# EAGLE design USB_RS232_Adaper_V1 (EAGLE 9.6.2)
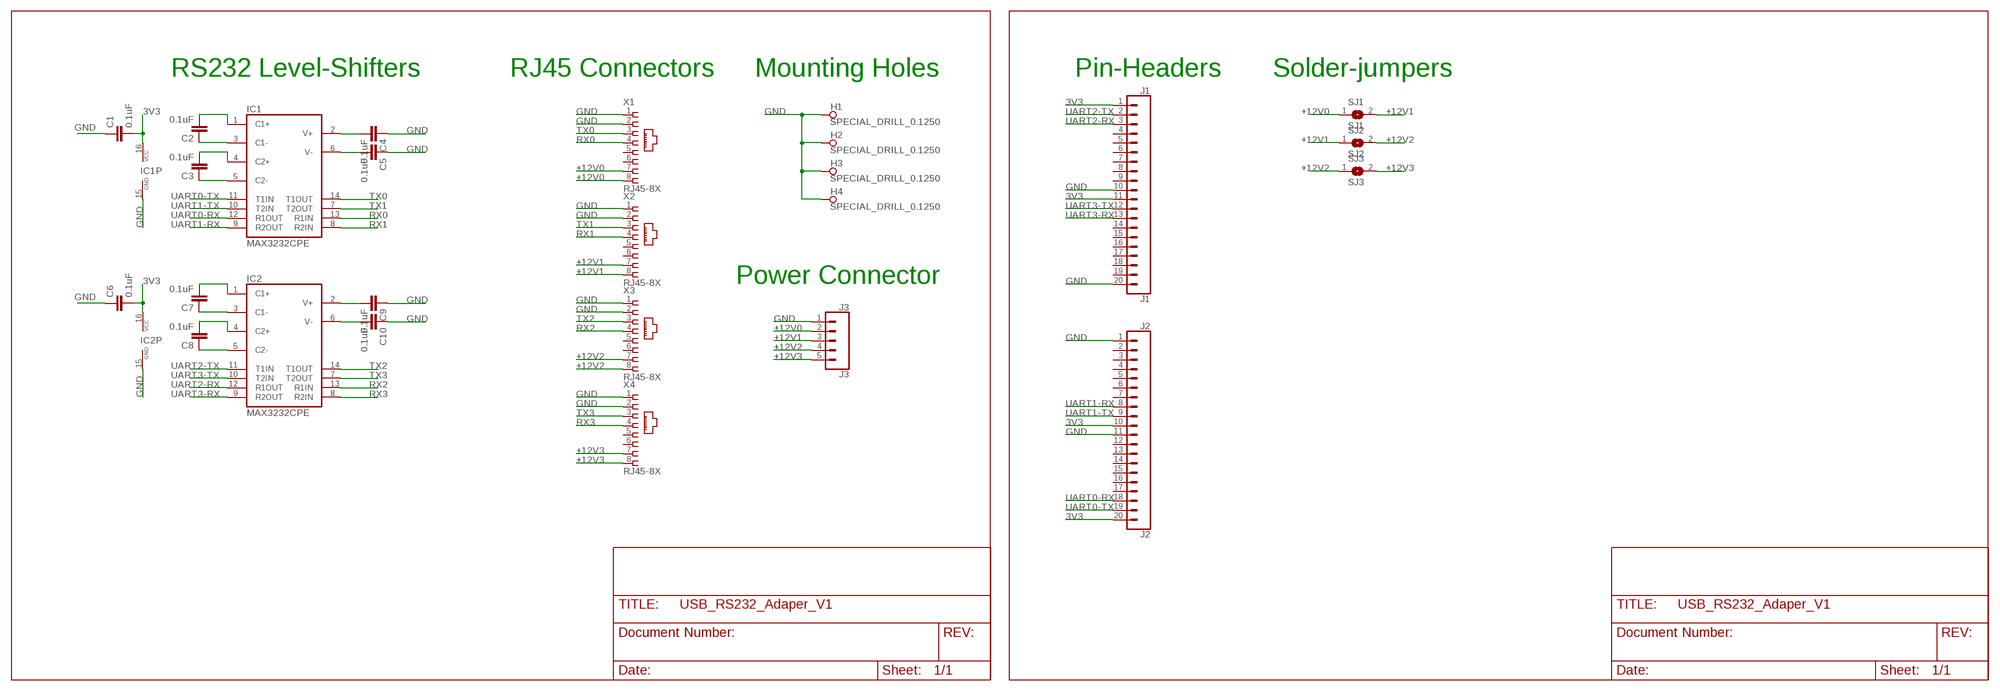
[diagram p0: schematic, sheet 1]

## Parts
C1  0.1uF  0.1UF-KIT-EZ-50V-20%  [CAP-PTH-SMALL-KIT]
C2  0.1uF  0.1UF-KIT-EZ-50V-20%  [CAP-PTH-SMALL-KIT]
C3  0.1uF  0.1UF-KIT-EZ-50V-20%  [CAP-PTH-SMALL-KIT]
C4  0.1uF  0.1UF-KIT-EZ-50V-20%  [CAP-PTH-SMALL-KIT]
C5  0.1uF  0.1UF-KIT-EZ-50V-20%  [CAP-PTH-SMALL-KIT]
C6  0.1uF  0.1UF-KIT-EZ-50V-20%  [CAP-PTH-SMALL-KIT]
C7  0.1uF  0.1UF-KIT-EZ-50V-20%  [CAP-PTH-SMALL-KIT]
C8  0.1uF  0.1UF-KIT-EZ-50V-20%  [CAP-PTH-SMALL-KIT]
C9  0.1uF  0.1UF-KIT-EZ-50V-20%  [CAP-PTH-SMALL-KIT]
C10  0.1uF  0.1UF-KIT-EZ-50V-20%  [CAP-PTH-SMALL-KIT]
H1  SPECIAL_DRILL_0.1250  [PAD_0.1250]
H2  SPECIAL_DRILL_0.1250  [PAD_0.1250]
H3  SPECIAL_DRILL_0.1250  [PAD_0.1250]
H4  SPECIAL_DRILL_0.1250  [PAD_0.1250]
IC1  MAX3232CPE  [DIL16]
IC2  MAX3232CPE  [DIL16]
J1  J1  CONN_20  [1X20]
J2  J2  CONN_20  [1X20]
J3  J3  CONN_05  [1X05]
SJ1  SJ1  SJ  [SJ]
SJ2  SJ2  SJ  [SJ]
SJ3  SJ3  SJ  [SJ]
X1  RJ45-8X  [RJ45-NO-SHIELD]
X2  RJ45-8X  [RJ45-NO-SHIELD]
X3  RJ45-8X  [RJ45-NO-SHIELD]
X4  RJ45-8X  [RJ45-NO-SHIELD]

## Nets
3V3: C1.2 C6.2 IC1.16(VCC) IC2.16(VCC) J1.1 J1.11 J2.10 J2.20
+12V0: J3.2 SJ1.1 X1.7 X1.8
+12V1: J3.3 SJ1.2 SJ2.1 X2.7 X2.8
+12V2: J3.4 SJ2.2 SJ3.1 X3.7 X3.8
+12V3: J3.5 SJ3.2 X4.7 X4.8
GND: C1.1 C4.1 C5.1 C6.1 C9.1 C10.1 H1.1 H2.1 H3.1 H4.1 IC1.15(GND) IC2.15(GND) J1.10 J1.20 J2.1 J2.11 J3.1 X1.1 X1.2 X2.1 X2.2 X3.1 X3.2 X4.1 X4.2
N$1: C4.2 IC1.2(V+)
N$2: C5.2 IC1.6(V-)
N$3: C2.1 IC1.3(C1-)
N$4: C2.2 IC1.1(C1+)
N$5: C3.1 IC1.5(C2-)
N$6: C3.2 IC1.4(C2+)
N$7: C9.2 IC2.2(V+)
N$8: C10.2 IC2.6(V-)
N$9: C7.1 IC2.3(C1-)
N$10: C7.2 IC2.1(C1+)
N$11: C8.1 IC2.5(C2-)
N$12: C8.2 IC2.4(C2+)
RX0: IC1.13(R1IN) X1.4
RX1: IC1.8(R2IN) X2.4
RX2: IC2.13(R1IN) X3.4
RX3: IC2.8(R2IN) X4.4
TX0: IC1.14(T1OUT) X1.3
TX1: IC1.7(T2OUT) X2.3
TX2: IC2.14(T1OUT) X3.3
TX3: IC2.7(T2OUT) X4.3
UART0-RX: IC1.12(R1OUT) J2.18
UART0-TX: IC1.11(T1IN) J2.19
UART1-RX: IC1.9(R2OUT) J2.8
UART1-TX: IC1.10(T2IN) J2.9
UART2-RX: IC2.12(R1OUT) J1.3
UART2-TX: IC2.11(T1IN) J1.2
UART3-RX: IC2.9(R2OUT) J1.13
UART3-TX: IC2.10(T2IN) J1.12
Unconnected: J1.4 J1.5 J1.6 J1.7 J1.8 J1.9 J1.14 J1.15 J1.16 J1.17 J1.18 J1.19 J2.2 J2.3 J2.4 J2.5 J2.6 J2.7 J2.12 J2.13 J2.14 J2.15 J2.16 J2.17 X1.5 X1.6 X2.5 X2.6 X3.5 X3.6 X4.5 X4.6

## Notes on the sheet
- RS232 Level-Shifters | RJ45 Connectors | Mounting Holes | Pin-Headers | Solder-jumpers
- Power Connector

## Library data of the parts
C1-C10 = SparkFun-Capacitors:0.1UF: 0.1µF ceramic capacitors A capacitor is a passive two-terminal electrical component used to store electrical energy temporarily in an electric field.; PROD_ID: CAP-08370
H1-H4 = special-drill:SPECIAL_DRILL_: Special drills
IC1 IC2 = maxim:MAX3232*: True RS-232 Transceivers 3.0V to 5.5V, Low-Power up to 1Mbps, Using Four 0.1µF External Capacitors Source: http://pdfserv.maxim-ic.com/en/ds/MAX3222-MAX3241.pdf; MF: MAXIM; MPN: MAX3232CPE+; OC_FARNELL: 9724494; OC_NEWARK: 68K4626
J1 J2 = SparkFun-Connectors:CONN_20: Multi connection point. Often used as Generic Header-pin footprint for 0.1 inch spaced/style header connections On any of the 0.1 inch spaced packages, you can populate with these: Break Away Headers - Straight <https://www.sparkfun.com/products/116> (PRT-00116) Break Away Male Headers - Right Angle <https://www.sparkfun.com/products/553> (PRT-00553) Female Headers <https://www.sparkfun.com/products/115> (PRT-00115) Break Away Headers - Machine Pin <https://www.sparkfun.com/products/117> (PRT-00117) Break Away Female Headers - Swiss Machine Pin <https://www.sparkfun.com/products/743> (PRT-00743) For SCREWTERMINALS and SPRING TERMINALS visit here: Screw Terimnals on SparkFun.com <https://www.sparkfun.com/search/results?term=Screw+Terminals> (5mm/3.5mm/2.54mm spacing) This device is also useful as a general connection point to wire up your design to another part of your project. Our various solder wires solder well into these plated through hole pads. Hook-Up Wire - Assortment (Stranded, 22 AWG) <https://www.sparkfun.com/products/11375> (PRT-11375) Hook-Up Wire - Assortment (Solid Core, 22 AWG) <https://www.sparkfun.com/products/11367> (PRT-11367) View the entire wire category on our website here <https://www.sparkfun.com/categories/141> Special notes: Molex polarized connector foot print use with SKU : PRT-08231 with associated crimp pins and housings. 1MM SMD Version SKU: PRT-10208 NOTES ON THE VARIANTS LOCK and LOCK_LONGPADS... This footprint was designed to help hold the alignment of a through-hole component (i.e. 6-pin header) while soldering it into place. You may notice that each hole has been shifted either up or down by 0.005 of an inch from it's more standard position (which is a perfectly straight line). This slight alteration caused the pins (the squares in the middle) to touch the edges of the holes. Because they are alternating, it causes a "brace" to hold the component in place. 0.005 has proven to be the perfect amount of "off-center" position when using our standard breakaway headers. Although looks a little odd when you look at the bare footprint, once you have a header in there, the alteration is very hard to notice. Also,if you push a header all the way into place, it is covered up entirely on the bottom side. Note about LOCK SPECIAL package: This is just like the LOCK variant in that the holes are staggared by 5 mil, but except for the last two holes. They are not altered from the "standard" footprint layout. This is used for a special purpose on the layout of our Graphic LCD Backpack. Make sure you want to use this device before selecting it for you project!
J3 = SparkFun-Connectors:CONN_05: Multi connection point. Often used as Generic Header-pin footprint for 0.1 inch spaced/style header connections On any of the 0.1 inch spaced packages, you can populate with these: Break Away Headers - Straight <https://www.sparkfun.com/products/116> (PRT-00116) Break Away Male Headers - Right Angle <https://www.sparkfun.com/products/553> (PRT-00553) Female Headers <https://www.sparkfun.com/products/115> (PRT-00115) Break Away Headers - Machine Pin <https://www.sparkfun.com/products/117> (PRT-00117) Break Away Female Headers - Swiss Machine Pin <https://www.sparkfun.com/products/743> (PRT-00743) For SCREWTERMINALS and SPRING TERMINALS visit here: Screw Terimnals on SparkFun.com <https://www.sparkfun.com/search/results?term=Screw+Terminals> (5mm/3.5mm/2.54mm spacing) This device is also useful as a general connection point to wire up your design to another part of your project. Our various solder wires solder well into these plated through hole pads. Hook-Up Wire - Assortment (Stranded, 22 AWG) <https://www.sparkfun.com/products/11375> (PRT-11375) Hook-Up Wire - Assortment (Solid Core, 22 AWG) <https://www.sparkfun.com/products/11367> (PRT-11367) View the entire wire category on our website here <https://www.sparkfun.com/categories/141> Special notes: Molex polarized connector foot print use with SKU : PRT-08231 with associated crimp pins and housings. 1MM SMD Version SKU: PRT-10208
SJ1-SJ3 = jumper:SJ: SMD solder JUMPER
X1-X4 = con-tycoelectronics:RJ45: CORCOM Modular RJ Jacks No Shield Source: www.tycoelectronics.com .. ENG_DS_1654001_1099_RJ_L_0507.pdf; MPN: RJ45-8X; OC_FARNELL: unknown; OC_NEWARK: 16R6101

## Board
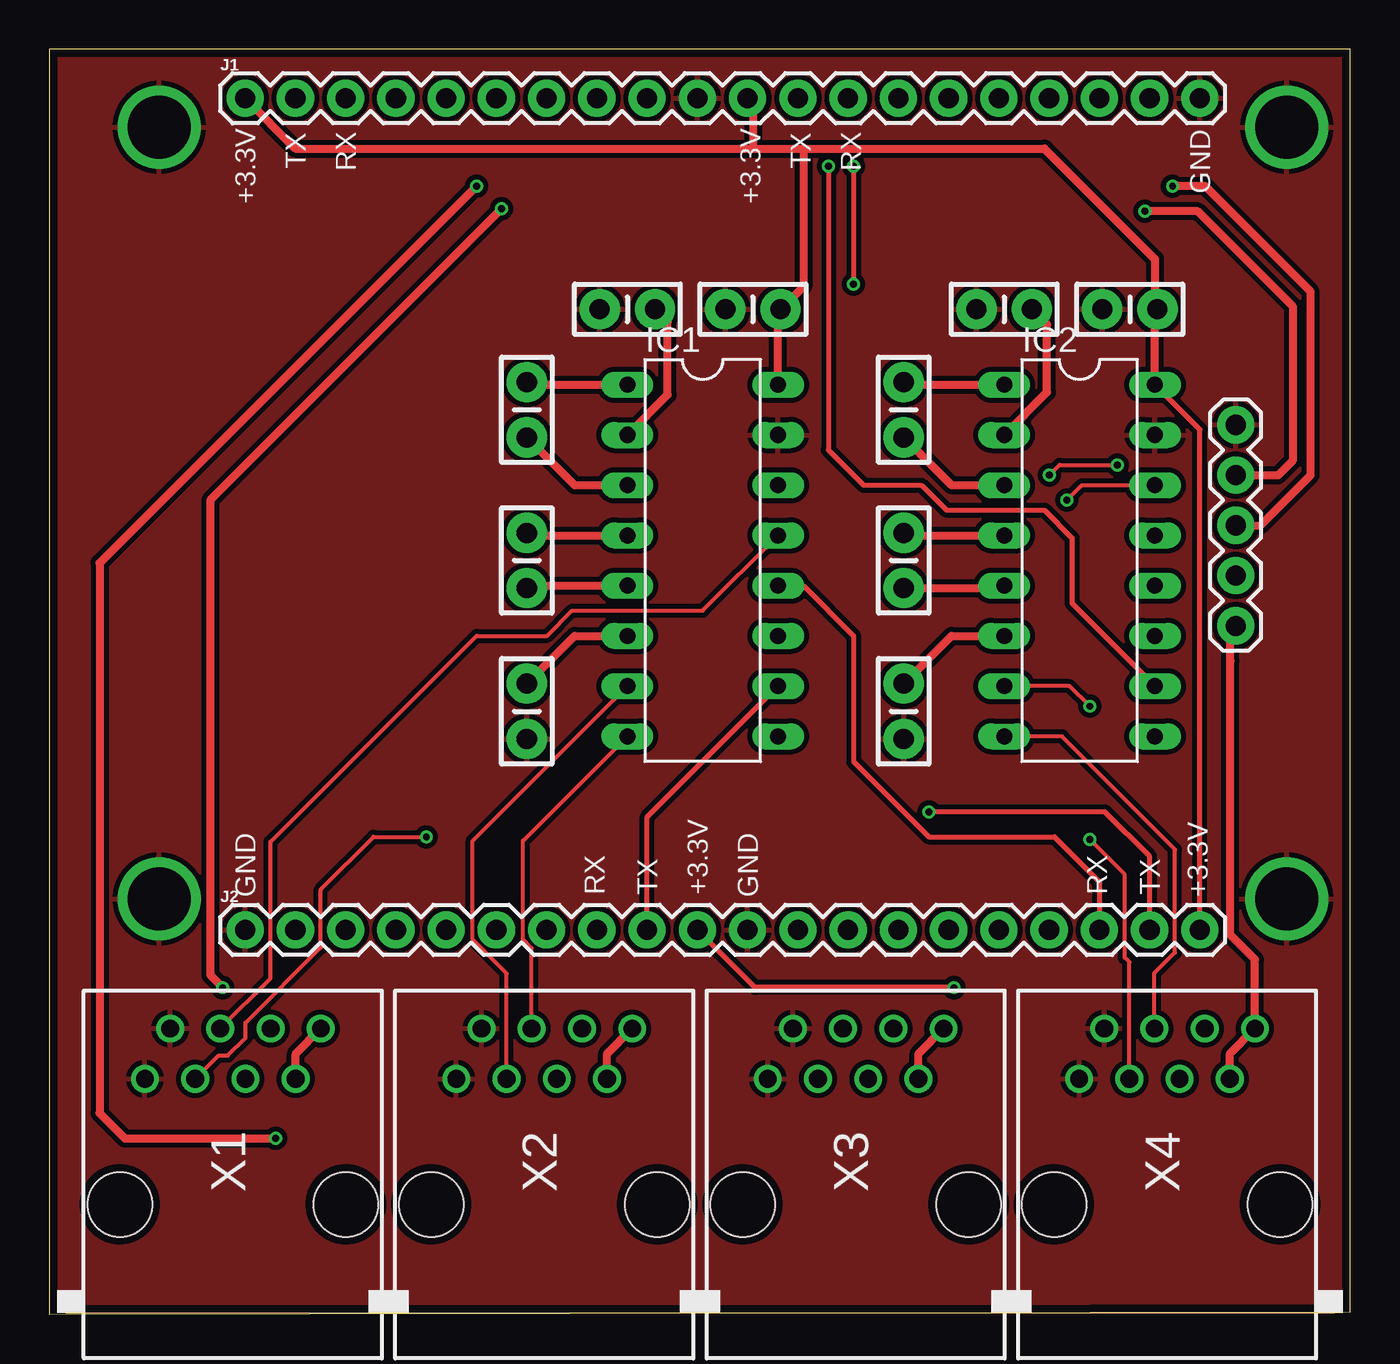
[diagram p1: board, top side]
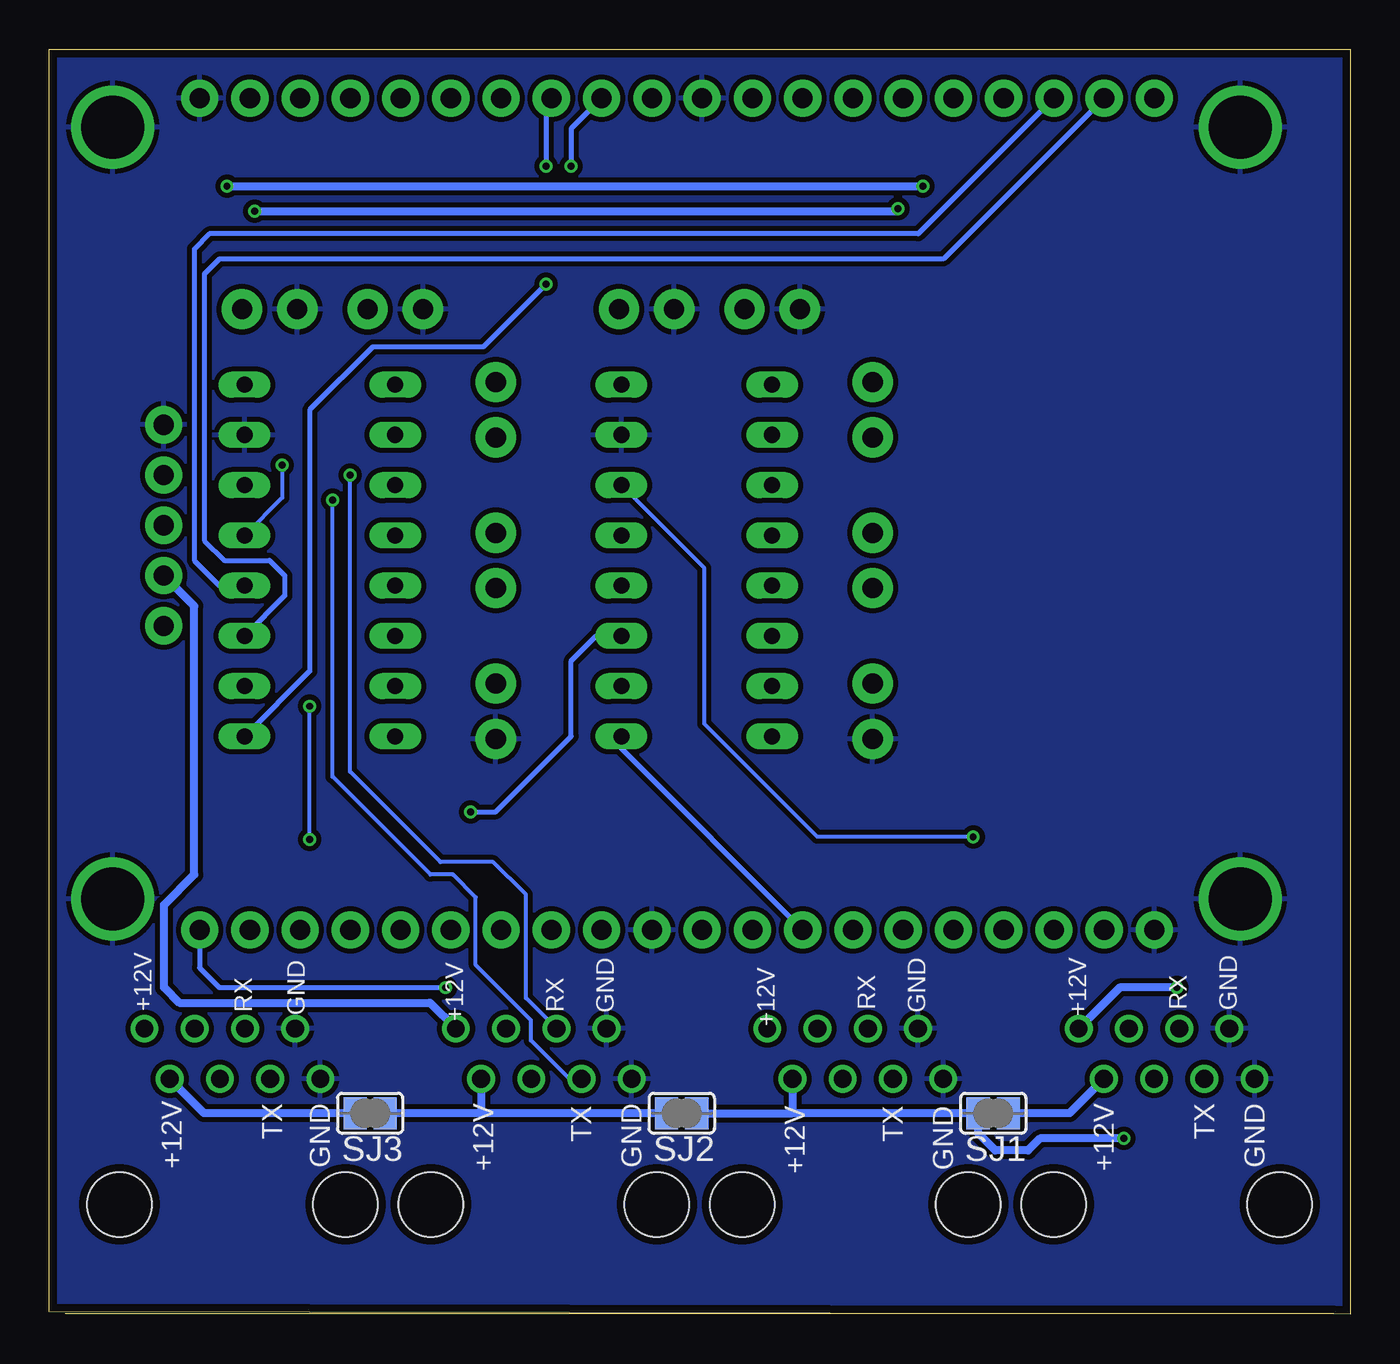
[diagram p2: board, bottom side, seen from below]

Size 65.74 x 63.93 mm. Coordinates in mm from the lower left corner, seen from the top.
Outline: 0,0 65.74,0.13 65.74,63.93 0,63.93 0,0
Copper layers (1*16): Top 0.035mm / dielectric 1.5mm / Bottom 0.035mm
Design rules "NOA Eagle Rule 2016-06-12": minimum track width 6mil, minimum drill 0.3mm, track to track 6mil, track to pad 6mil, pad to pad 6mil, via to via 6mil, smd to smd 0mil, copper to edge 0.4mm, drill to drill 10mil, minimum pad ring 10mil, minimum via ring 6mil, stop-mask expansion 2mil, vias tented up to drill 25mil, thermal gap 10mil

### Footprints (pad centres in the part's own frame; a part is rotated, then mirrored left to right if it is on the bottom)
CAP-PTH-SMALL-KIT = drill 1.016 pad 2.032: 1 -1.397,0; 2 1.397,0
PAD_0.1250 = drill 3.175 pad 3.175: 1 0,0
DIL16 = drill 0.813 long: 1 -8.89,-3.81; 2 -6.35,-3.81; 3 -3.81,-3.81; 4 -1.27,-3.81; 5 1.27,-3.81; 6 3.81,-3.81; 7 6.35,-3.81; 8 8.89,-3.81; 9 8.89,3.81; 10 6.35,3.81; 11 3.81,3.81; 12 1.27,3.81; 13 -1.27,3.81; 14 -3.81,3.81; 15 -6.35,3.81; 16 -8.89,3.81
1X20 = drill 1.016 pad 1.88: 1 0,0; 2 2.54,0; 3 5.08,0; 4 7.62,0; 5 10.16,0; 6 12.7,0; 7 15.24,0; 8 17.78,0; 9 20.32,0; 10 22.86,0; 11 25.4,0; 12 27.94,0; 13 30.48,0; 14 33.02,0; 15 35.56,0; 16 38.1,0; 17 40.64,0; 18 43.18,0; 19 45.72,0; 20 48.26,0
1X05 = drill 1.016 pad 1.88: 1 0,0; 2 2.54,0; 3 5.08,0; 4 7.62,0; 5 10.16,0
SJ = smd 1.168 x 1.6: 1 -0.762,0; 2 0.762,0
RJ45-NO-SHIELD = drill 0.9 pad 1.4: 1 -4.445,6.35; 2 -3.175,8.89; 3 -1.905,6.35; 4 -0.635,8.89; 5 0.635,6.35; 6 1.905,8.89; 7 3.175,6.35; 8 4.445,8.89 | hole 3.251: -5.715,0; 5.715,0

### Placement (x,y rotation side)
C1  35.56,50.8 0 top
C2  24.13,45.72 90 top
C3  24.13,38.1 90 top
C4  29.21,50.8 0 top
C5  24.13,30.48 90 top
C6  54.61,50.8 0 top
C7  43.18,45.72 90 top
C8  43.18,38.1 90 top
C9  48.26,50.8 0 top
C10  43.18,30.48 90 top
H1  5.54,60 0 top
H2  5.54,21 0 top
H3  62.54,60 0 top
H4  62.54,21 0 top
IC1  33.02,38.1 270 top
IC2  52.07,38.1 270 top
J1  9.89,61.47 0 top
J2  9.89,19.43 0 top
J3  59.96,44.96 270 top
SJ1  18.03,10.16 180 bottom
SJ2  33.78,10.16 180 bottom
SJ3  49.53,10.16 180 bottom
X1  9.27,5.55 0 top
X2  25.01,5.55 0 top
X3  40.75,5.55 0 top
X4  56.49,5.55 0 top

### Tracks (layer width: path | path; a pad name or v marks a point on that pad's centre or on a via)
3V3  (via drill 0.35)
  Top 0.254: J2.20 58.15,44.72 IC2.16 | v45.72,16.51 35.67,16.51 J2.10
  Top 0.406: IC1.16 36.83,50.67 C1.2 38.1,51.94 38.1,58.93 | IC2.16 55.88,50.67 | 55.88,50.67 C6.2 | J1.1 12.43,58.93 35.56,58.93 | 35.56,58.93 38.1,58.93 | 38.1,58.93 50.29,58.93 55.88,53.34 55.88,50.67 | J1.11 35.56,61.2 35.56,58.93
  Bottom 0.254: J2.20 58.15,17.51 57.15,16.51 v45.72,16.51
+12V0  (via drill 0.35)
  Top 0.406: X1.7 12.45,13.17 X1.8 | J3.2 62.1,42.42 62.87,43.18 62.87,50.93 58.17,55.63 58.04,55.75 v55.37,55.75 | v22.86,55.88 8.13,41.15 8.13,17.14 v8.76,16.51
  Bottom 0.406: X1.7 14.19,10.16 SJ1.1 | v55.37,55.75 22.99,55.75 v22.86,55.88 | v8.76,16.51 11.65,16.51 X1.8
+12V1  (via drill 0.35)
  Top 0.406: X2.7 28.19,13.17 X2.8 | J3.3 61.21,39.88 63.75,42.42 63.75,51.69 58.42,57.02 v56.77,57.02 | v21.59,57.02 2.54,37.97 2.54,10.16 3.81,8.89 v11.43,8.89
  Bottom 0.406: 28.19,10.16 SJ1.2 18.8,9.14 17.93,8.28 16.28,8.28 15.67,8.89 v11.43,8.89 | SJ2.1 28.19,10.16 | v56.77,57.02 v21.59,57.02 | X2.7 28.19,10.16
+12V2
  Top 0.406: X3.7 43.93,13.17 X3.8
  Bottom 0.406: SJ2.2 43.94,10.16 | 43.94,10.16 SJ3.1 | X3.8 46.5,15.75 59.18,15.75 59.94,16.51 59.94,20.7 58.42,22.23 58.42,35.8 J3.4 | X3.7 43.93,10.18 43.94,10.16
+12V3
  Top 0.406: X4.7 59.67,13.17 X4.8 60.94,17.93 59.69,19.18 59.69,33.02 59.69,33.53 59.69,34.53 J3.5
  Bottom 0.406: SJ3.2 57.93,10.16 X4.7
GND
  pour Top (isolate 0.254): -1.27,66.55 -1.27,-2.54 67.31,-2.54 67.31,66.55
  pour Bottom (isolate 0.254): -1.27,66.55 -1.27,-2.54 67.31,-2.54 67.31,66.55
N$1
  Top 0.406: IC1.2 31.24,46.48 31.24,50.16 C4.2
N$2
  Top 0.406: C5.2 26.54,34.29 IC1.6
N$3
  Top 0.406: C2.1 26.54,41.91 IC1.3
N$4
  Top 0.406: C2.2 24.26,46.99 IC1.1
N$5
  Top 0.406: C3.1 24.26,36.83 IC1.5
N$6
  Top 0.406: C3.2 24.26,39.37 IC1.4
N$7
  Top 0.406: IC2.2 50.42,46.61 50.42,50.04 C9.2
N$8
  Top 0.406: C10.2 45.59,34.29 IC2.6
N$9
  Top 0.406: C7.1 45.59,41.91 IC2.3
N$10
  Top 0.406: C7.2 43.31,46.99 IC2.1
N$11
  Top 0.406: C8.1 48.13,36.7 IC2.5
N$12
  Top 0.406: C8.2 43.31,39.37 IC2.4
RX0
  Top 0.203: X1.4 11.18,16.98 11.18,23.88 21.59,34.29 25.15,34.29 26.42,35.56 33.02,35.56 IC1.13
RX1
  Top 0.203: X2.4 24.38,18.5 23.94,18.94 23.94,23.94 IC1.8
RX2  (via drill 0.35)
  Top 0.203: v50.55,42.42 51.05,42.93 v53.98,42.93
  Bottom 0.203: X3.4 41.66,15.98 41.66,21.21 43.31,22.86 45.97,22.86 50.55,27.43 v50.55,42.42 | v53.98,42.93 53.98,41.27 IC2.13
RX3
  Top 0.203: X4.4 55.86,17.25 56.9,18.29 56.9,23.5 51.18,29.21 IC2.8
TX0  (via drill 0.35)
  Top 0.203: X1.3 8.55,13.08 9.02,13.08 9.91,13.97 9.91,14.73 13.72,18.54 13.72,21.46 16.38,24.13 v19.05,24.13
  Bottom 0.203: v19.05,24.13 26.92,24.13 32.64,29.84 32.64,37.72 IC1.14
TX1
  Top 0.203: X2.3 23.11,17.23 21.4,18.94 21.4,23.94 IC1.7
TX2  (via drill 0.35)
  Top 0.203: v51.44,41.15 52.2,41.91 IC2.14
  Bottom 0.203: X3.3 39.46,11.9 41.4,13.84 41.4,14.86 44.2,17.65 44.2,21.08 45.34,22.23 46.48,22.23 51.44,27.18 v51.44,41.15
TX3  (via drill 0.35)
  Top 0.203: X4.3 54.59,17.8 54.36,18.03 54.36,22.23 v52.58,24 | v52.58,30.73 51.56,31.75 IC2.7
  Bottom 0.203: v52.58,24 v52.58,30.73
UART0-RX
  Top 0.254: IC1.12 38.1,36.83 40.64,34.29 40.64,27.94 44.45,24.13 50.8,24.13 53.07,21.86 J2.18
UART0-TX  (via drill 0.35)
  Top 0.254: J2.19 55.61,23.13 53.34,25.4 v44.45,25.4
  Bottom 0.254: v44.45,25.4 43.18,25.4 39.37,29.21 39.37,33.02 38.1,34.29 IC1.11
UART1-RX
  Bottom 0.254: J2.8 36.83,28.59 IC1.9
UART1-TX
  Top 0.254: J2.9 30.21,25.13 IC1.10
UART2-RX
  Bottom 0.254: J1.3 21.83,54.61 57.66,54.61 58.42,53.85 58.42,38.1 57.15,36.83 IC2.12
UART2-TX
  Bottom 0.254: J1.2 20.56,53.34 57.15,53.34 57.91,52.58 57.91,39.12 56.9,38.1 54.61,38.1 53.85,37.34 53.85,36.32 IC2.11
UART3-RX  (via drill 0.35)
  Top 0.254: v40.64,58.04 v40.64,52.07
  Bottom 0.254: J1.13 40.64,61.2 v40.64,58.04 | v40.64,52.07 43.81,48.9 49.4,48.9 52.58,45.72 52.58,32.51 IC2.9
UART3-TX  (via drill 0.35)
  Top 0.254: v39.37,58.04 39.37,43.69 41.15,41.91 44.07,41.91 45.34,40.64 50.29,40.64 51.69,39.24 51.69,35.94 IC2.10
  Bottom 0.254: J1.12 39.37,59.93 v39.37,58.04

### Text on the board
tNames: TX | RX | TX | RX | GND | +3.3V | +3.3V | GND | RX | TX | +3.3V | GND | RX | TX | +3.3V
bNames: GND | +12V | GND | +12V | GND | +12V | GND | +12V | RX | RX | RX | RX | GND | TX | +12V | GND | TX | +12V | GND | TX | +12V | GND | TX | +12V